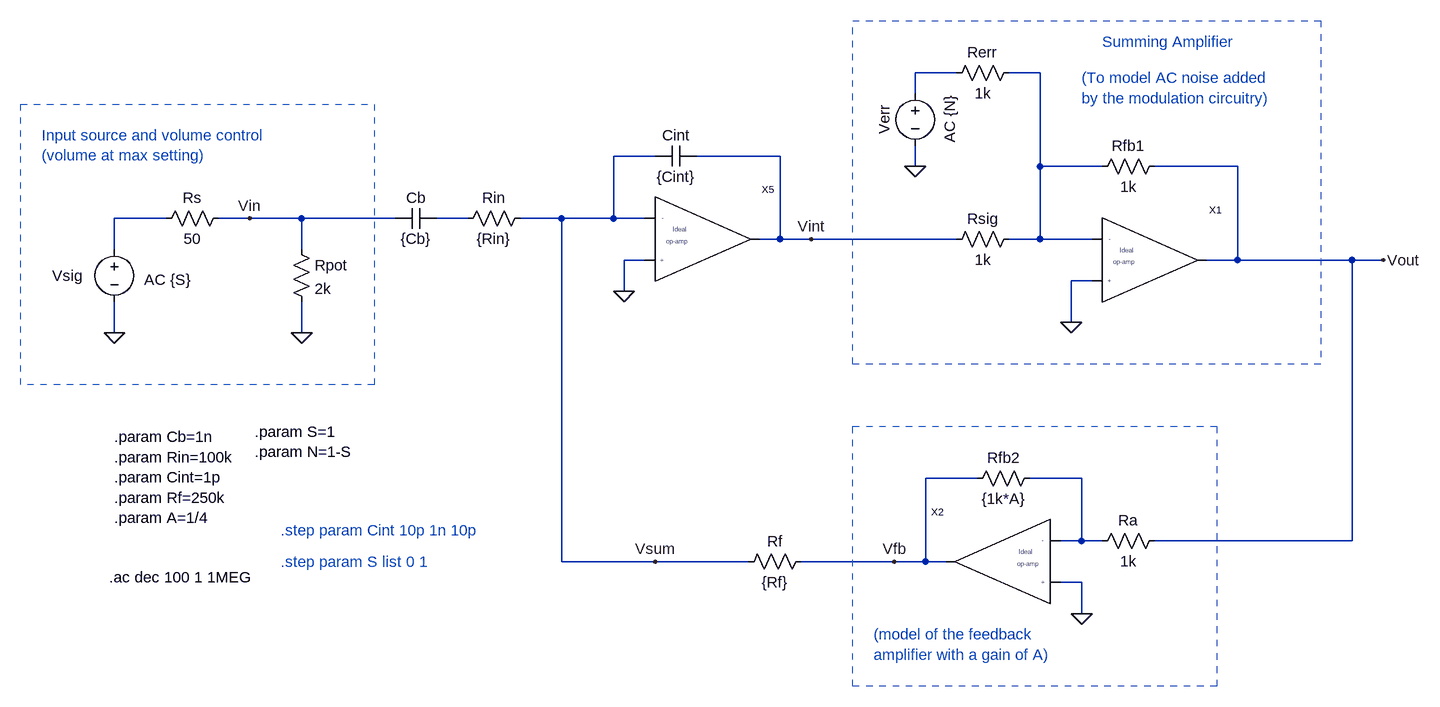
[diagram p0: schematic TransferFunction.asc]
TransferFunction.asc, the LTspice schematic file:
Version 4
SHEET 1 4296 696
WIRE 2320 -608 2256 -608
WIRE 2448 -608 2400 -608
WIRE 2256 -576 2256 -608
WIRE 1856 -480 1792 -480
WIRE 2048 -480 1920 -480
WIRE 2256 -464 2256 -496
WIRE 2448 -464 2448 -608
WIRE 2544 -464 2448 -464
WIRE 2752 -464 2624 -464
WIRE 1104 -384 1024 -384
WIRE 1232 -384 1184 -384
WIRE 1312 -384 1232 -384
WIRE 1456 -384 1312 -384
WIRE 1568 -384 1520 -384
WIRE 1712 -384 1648 -384
WIRE 1792 -384 1792 -480
WIRE 1792 -384 1712 -384
WIRE 1840 -384 1792 -384
WIRE 2048 -352 2048 -480
WIRE 2048 -352 2016 -352
WIRE 2096 -352 2048 -352
WIRE 2320 -352 2096 -352
WIRE 2448 -352 2448 -464
WIRE 2448 -352 2400 -352
WIRE 2528 -352 2448 -352
WIRE 1024 -336 1024 -384
WIRE 1312 -336 1312 -384
WIRE 1840 -320 1808 -320
WIRE 2752 -320 2752 -464
WIRE 2752 -320 2704 -320
WIRE 2928 -320 2752 -320
WIRE 2976 -320 2928 -320
WIRE 2528 -288 2496 -288
WIRE 1808 -272 1808 -320
WIRE 2496 -224 2496 -288
WIRE 1024 -208 1024 -256
WIRE 1312 -208 1312 -256
WIRE 2352 16 2272 16
WIRE 2512 16 2432 16
WIRE 2512 112 2512 16
WIRE 2512 112 2480 112
WIRE 2544 112 2512 112
WIRE 2928 112 2928 -320
WIRE 2928 112 2624 112
WIRE 1712 144 1712 -384
WIRE 1856 144 1712 144
WIRE 2000 144 1856 144
WIRE 2224 144 2080 144
WIRE 2272 144 2272 16
WIRE 2272 144 2224 144
WIRE 2304 144 2272 144
WIRE 2512 176 2480 176
WIRE 2512 224 2512 176
FLAG 1024 -208 0
FLAG 1232 -384 Vin
FLAG 2096 -352 Vint
FLAG 1856 144 Vsum
FLAG 2256 -464 0
FLAG 1808 -272 0
FLAG 2496 -224 0
FLAG 2512 224 0
FLAG 2976 -320 Vout
FLAG 1312 -208 0
FLAG 2224 144 Vfb
SYMBOL voltage 1024 -352 R0
WINDOW 123 46 62 Left 2
WINDOW 39 0 0 Left 2
WINDOW 3 58 -13 VRight 2
WINDOW 0 -96 56 Left 2
SYMATTR Value2 AC {S}
SYMATTR Value ""
SYMATTR InstName Vsig
SYMBOL res 1552 -368 R270
WINDOW 0 32 56 VTop 2
WINDOW 3 0 56 VBottom 2
SYMATTR InstName Rin
SYMATTR Value {Rin}
SYMBOL cap 1920 -496 R90
WINDOW 0 0 32 VBottom 2
WINDOW 3 32 32 VTop 2
SYMATTR InstName Cint
SYMATTR Value {Cint}
SYMBOL res 1984 160 R270
WINDOW 0 32 56 VTop 2
WINDOW 3 0 56 VBottom 2
SYMATTR InstName Rf
SYMATTR Value {Rf}
SYMBOL Ideal_op_amp 1856 -352 R0
SYMATTR InstName X5
SYMBOL res 1088 -368 R270
WINDOW 0 32 56 VTop 2
WINDOW 3 0 56 VBottom 2
SYMATTR InstName Rs
SYMATTR Value 50
SYMBOL cap 1456 -368 R270
WINDOW 0 32 32 VTop 2
WINDOW 3 0 32 VBottom 2
SYMATTR InstName Cb
SYMATTR Value {Cb}
SYMBOL Ideal_op_amp 2544 -320 R0
SYMATTR InstName X1
SYMBOL res 2304 -336 R270
WINDOW 0 32 56 VTop 2
WINDOW 3 0 56 VBottom 2
SYMATTR InstName Rsig
SYMATTR Value 1k
SYMBOL res 2416 -624 R90
WINDOW 0 0 56 VBottom 2
WINDOW 3 32 56 VTop 2
SYMATTR InstName Rerr
SYMATTR Value 1k
SYMBOL res 2528 -448 R270
WINDOW 0 32 56 VTop 2
WINDOW 3 0 56 VBottom 2
SYMATTR InstName Rfb1
SYMATTR Value 1k
SYMBOL voltage 2256 -592 M0
WINDOW 0 32 56 VTop 2
WINDOW 3 -32 56 VBottom 2
WINDOW 123 -69 55 VTop 2
WINDOW 39 0 0 Left 2
SYMATTR InstName Verr
SYMATTR Value ""
SYMATTR Value2 AC {N}
SYMBOL Ideal_op_amp 2464 144 M0
SYMATTR InstName X2
SYMBOL res 2528 128 R270
WINDOW 0 32 56 VTop 2
WINDOW 3 0 56 VBottom 2
SYMATTR InstName Ra
SYMATTR Value 1k
SYMBOL res 2336 32 R270
WINDOW 0 32 56 VTop 2
WINDOW 3 0 56 VBottom 2
SYMATTR InstName Rfb2
SYMATTR Value {1k*A}
SYMBOL res 1296 -352 R0
SYMATTR InstName Rpot
SYMATTR Value 2k
TEXT 2544 -656 Left 2 ;Summing Amplifier
TEXT 1016 168 Left 2 !.ac dec 100 1 1MEG
TEXT 1024 -48 Left 2 !.param Cb=1n\n.param Rin=100k\n.param Cint=1p\n.param Rf=250k\n.param A=1/4
TEXT 1280 96 Left 2 ;.step param Cint 10p 1n 10p
TEXT 1240 -56 Left 2 !.param S=1\n.param N=1-S
TEXT 1280 144 Left 2 ;.step param S list 0 1
TEXT 2512 -600 Left 2 ;(To model AC noise added\nby the modulation circuitry)
TEXT 2192 256 Left 2 ;(model of the feedback\namplifier with a gain of A)
TEXT 912 -512 Left 2 ;Input source and volume control\n(volume at max setting)
RECTANGLE Normal 2880 -160 2160 -688 2
RECTANGLE Normal 2720 336 2160 -64 2
RECTANGLE Normal 1424 -128 880 -560 2

The netlist it stands for:
* TransferFunction.asc
Vsig N003 0 AC {S}
Rin N004 Vsum {Rin}
Cint Vint Vsum {Cint}
Rf Vsum Vfb {Rf}
XX5 Vsum 0 Vint Ideal_op_amp  ; pins Vinm Vinp Out
Rs N003 Vin 50
Cb Vin N004 {Cb}
XX1 N002 0 Vout Ideal_op_amp  ; pins Vinm Vinp Out
Rsig Vint N002 1k
Rerr N002 N001 1k
Rfb1 N002 Vout 1k
Verr N001 0 AC {N}
XX2 N005 0 Vfb Ideal_op_amp  ; pins Vinm Vinp Out
Ra N005 Vout 1k
Rfb2 Vfb N005 {1k*A}
Rpot Vin 0 2k
* Summing Amplifier
.ac dec 100 1 1MEG
.param Cb=1n
.param Rin=100k
.param Cint=1p
.param Rf=250k
.param A=1/4
* .step param Cint 10p 1n 10p
.param S=1
.param N=1-S
* .step param S list 0 1
* (To model AC noise added
* by the modulation circuitry)
* (model of the feedback
* amplifier with a gain of A)
* Input source and volume control
* (volume at max setting)
.backanno
.end

* Results of the author's LTspice run, read from the files saved beside the schematic
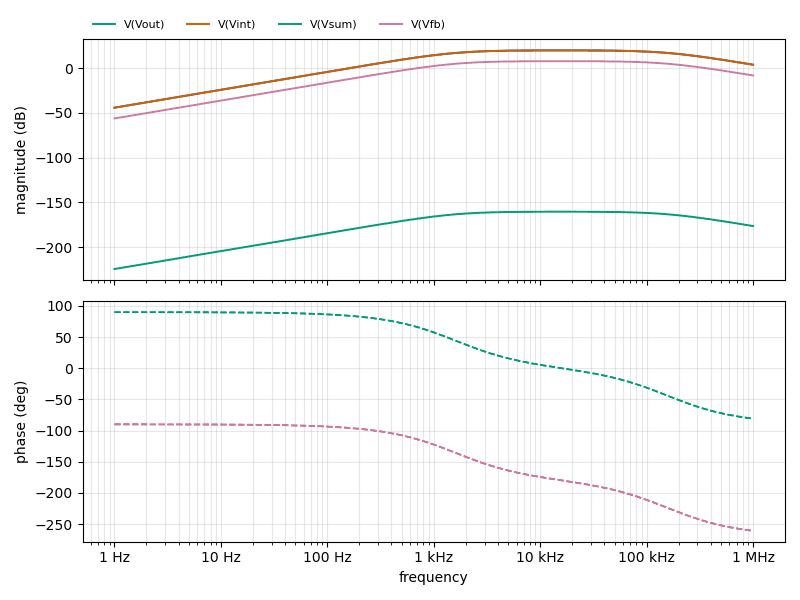
[diagram p1: AC Analysis of TransferFunction.asc, plotted from the saved traces]
* AC Analysis, 1 run:
*   V(Vout): -44.25 dB at 1 Hz, 3.71 dB at 1 MHz, peak 19.69 dB at 15.85 kHz, 3 dB below the peak at 1.56 kHz and 162.3 kHz
*   V(Vint): -44.25 dB at 1 Hz, 3.71 dB at 1 MHz, peak 19.69 dB at 15.85 kHz, 3 dB below the peak at 1.56 kHz and 162.3 kHz
*   V(Vsum): -224.25 dB at 1 Hz, -176.29 dB at 1 MHz, peak -160.31 dB at 15.85 kHz, 3 dB below the peak at 1.56 kHz and 162.3 kHz
*   V(Vfb): -56.29 dB at 1 Hz, -8.33 dB at 1 MHz, peak 7.65 dB at 15.85 kHz, 3 dB below the peak at 1.56 kHz and 162.3 kHz